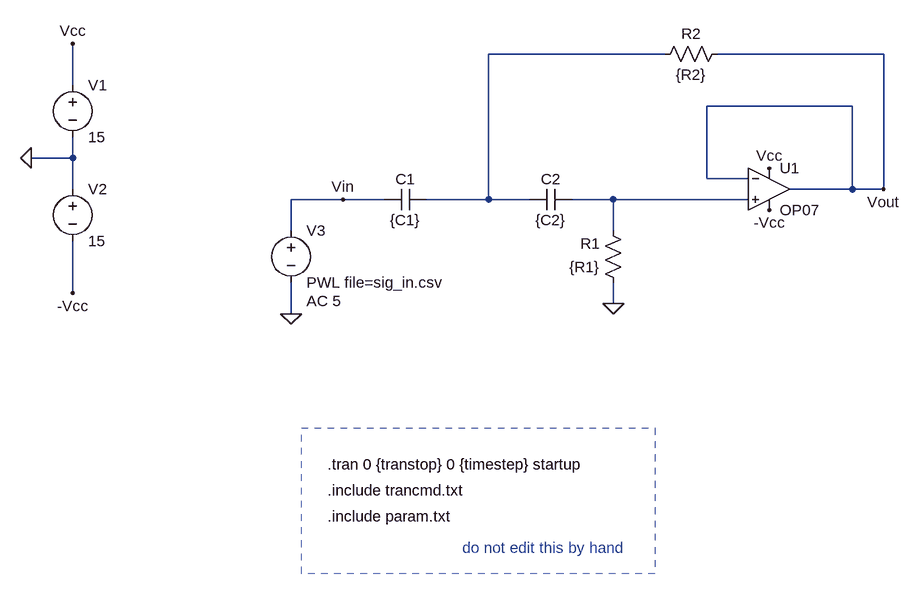
[diagram p0: schematic A4_AltaSK_2.asc]
A4_AltaSK_2.asc, the LTspice schematic file:
Version 4
SHEET 1 1096 680
WIRE 336 -368 64 -368
WIRE 672 -368 416 -368
WIRE -576 -320 -576 -384
WIRE 624 -288 400 -288
WIRE -576 -208 -576 -240
WIRE -576 -208 -640 -208
WIRE 400 -176 400 -288
WIRE 464 -176 400 -176
WIRE -576 -160 -576 -208
WIRE 624 -160 624 -288
WIRE 624 -160 528 -160
WIRE 672 -160 672 -368
WIRE 672 -160 624 -160
WIRE -160 -144 -240 -144
WIRE -96 -144 -160 -144
WIRE 64 -144 64 -368
WIRE 64 -144 -32 -144
WIRE 128 -144 64 -144
WIRE 256 -144 192 -144
WIRE 464 -144 256 -144
WIRE -240 -96 -240 -144
WIRE 256 -96 256 -144
WIRE -576 0 -576 -80
WIRE 256 16 256 -16
WIRE -240 32 -240 -16
FLAG 672 -160 Vout
FLAG 256 16 0
FLAG -160 -144 Vin
FLAG -640 -208 0
FLAG -576 -384 Vcc
FLAG -576 0 -Vcc
FLAG 496 -192 Vcc
FLAG 496 -128 -Vcc
FLAG -240 32 0
SYMBOL res 272 0 R180
WINDOW 0 36 76 Left 2
WINDOW 3 36 40 Left 2
SYMATTR InstName R1
SYMATTR Value {R1}
SYMBOL cap -96 -128 R270
WINDOW 0 32 32 VTop 2
WINDOW 3 0 32 VBottom 2
SYMATTR InstName C1
SYMATTR Value {C1}
SYMBOL OpAmps\\OP07 496 -224 R0
SYMATTR InstName U1
SYMBOL cap 192 -160 R90
WINDOW 0 0 32 VBottom 2
WINDOW 3 32 32 VTop 2
SYMATTR InstName C2
SYMATTR Value {C2}
SYMBOL voltage -576 -336 R0
WINDOW 123 0 0 Left 0
WINDOW 39 0 0 Left 0
SYMATTR InstName V1
SYMATTR Value 15
SYMBOL voltage -576 -176 R0
WINDOW 123 0 0 Left 0
WINDOW 39 0 0 Left 0
SYMATTR InstName V2
SYMATTR Value 15
SYMBOL voltage -240 -112 R0
WINDOW 123 24 124 Left 2
WINDOW 39 0 0 Left 0
SYMATTR Value2 AC 5
SYMATTR InstName V3
SYMATTR Value PWL file=sig_in.csv
SYMBOL res 432 -384 R90
WINDOW 0 0 56 VBottom 2
WINDOW 3 32 56 VTop 2
SYMATTR InstName R2
SYMATTR Value {R2}
TEXT -184 264 Left 2 !.tran 0 {transtop} 0 {timestep} startup
TEXT -184 344 Left 2 !.include param.txt
TEXT -184 304 Left 2 !.include trancmd.txt
TEXT 24 392 Left 2 ;do not edit this by hand
RECTANGLE Normal 320 432 -224 208 2

The netlist it stands for:
* A4_AltaSK_2.asc
R1 0 N002 {R1}
C1 Vin N001 {C1}
XU1 N002 Vout Vcc -Vcc Vout LT1001  ; OP07, pins In+ In- V+ V- OUT
C2 N002 N001 {C2}
V1 Vcc 0 15
V2 0 -Vcc 15
V3 Vin 0 PWL file=sig_in.csv AC 5
R2 Vout N001 {R2}
.tran 0 {transtop} 0 {timestep} startup
.include param.txt
.include trancmd.txt
* do not edit this by hand
.lib LTC.lib
.backanno
.end

* Results of the author's LTspice run, read from the files saved beside the schematic
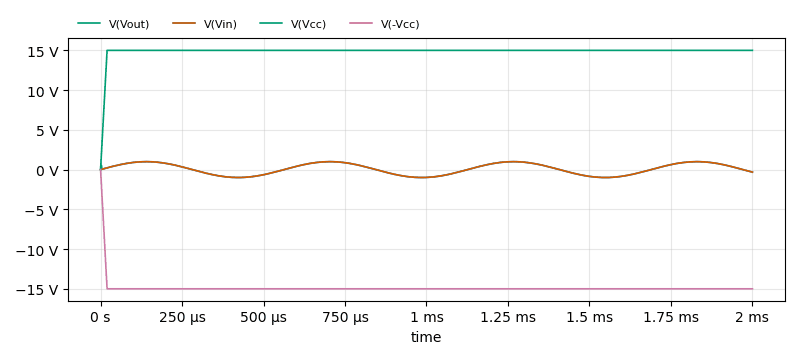
[diagram p1: Transient Analysis of A4_AltaSK_2.asc, plotted from the saved traces]
* Transient Analysis, 1 run:
*   V(Vout): min -1.003 V, max 996.7 mV, average 84.56 mV, rms 702.4 mV, last -323.5 mV
*   V(Vin): min -1 V, max 1 V, average 87.17 mV, rms 702.6 mV, last -319.2 mV
*   V(Vcc): min 0 V, max 15 V, average 14.92 V, rms 14.95 V, last 15 V
*   V(-Vcc): min -15 V, max 0 V, average -14.92 V, rms 14.95 V, last -15 V